# Altium schematic sheet IMU.SchDoc: MPU6000 IMU
size Letter; Revision: 1; SheetNumber: 3; SheetTotal: 3; Client: Facebook; LeaflabsProject: Sawyer
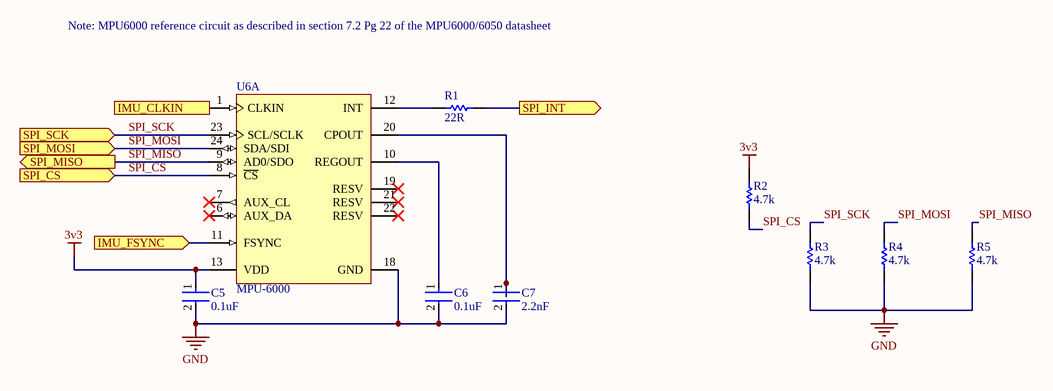
[diagram p0: IMU.SchDoc]

## Parts
C5  0.1uF  [FP-CC0603-DA-IPC_C]
C6  0.1uF  [FP-CC0603-DA-IPC_C]
C7  2.2nF  [FP-CC0603-DA-IPC_C]
R1  22R  [RESC1609X50X30LL10T20]
R2  4.7k  [RESC1609X50X30LL10T20]
R3  4.7k  [RESC1609X50X30LL10T20]
R4  4.7k  [RESC1609X50X30LL10T20]
R5  4.7k  [RESC1609X50X30LL10T20]
U6  MPU-6000  [QFN-24_NoPad]  (part A of 2)

## Ports
IMU_CLKIN (in), IMU_FSYNC (in), SPI_CS (in), SPI_INT (out), SPI_MISO (out), SPI_MOSI (in), SPI_SCK (in)

## Nets
3v3: C5.1 R2.2 U6.13(VDD)
GND: C5.2 C6.2 C7.2 R3.1 R4.1 R5.1 U6.18(GND)
IMU_CLKIN: U6.1(CLKIN) ; port IMU_CLKIN
IMU_FSYNC: U6.11(FSYNC) ; port IMU_FSYNC
SPI_CS: R2.1 U6.8(~{CS}) ; port SPI_CS
SPI_INT: R1.2 ; port SPI_INT
SPI_MISO: R5.2 U6.9(AD0/SDO) ; port SPI_MISO
SPI_MOSI: R4.2 U6.24(SDA/SDI) ; port SPI_MOSI
SPI_SCK: R3.2 U6.23(SCL/SCLK) ; port SPI_SCK
NetC6_1: C6.1 U6.10(REGOUT)
NetC7_1: C7.1 U6.20(CPOUT)
NetR1_1: R1.1 U6.12(INT)

Not connected (* = marked no-connect by the designer): U6 6(AUX_DA)* 7(AUX_CL)* 19(RESV)* 21(RESV)* 22(RESV)*

## Notes on the sheet
- Note: MPU6000 reference circuit as described in section 7.2 Pg 22 of the MPU6000/6050 datasheet
- PROJ
- TITLE
- CLIENT
- REV
- DATE
- LeafLabs
- SHEET
- OF
- CONFIDENTIAL. DO NOT DISTRIBUTE.

## Library data of the parts
C5 C6 = CAP-0603-0.1uF: CAP CER 0.1UF 16V X7R 0603; Manufacturer Part Number: CC0603KRX7R7BB104; Manufacturer: YAGEO; Tolerance: 0.1; Value: 100 nF; Temperature Coefficient: 15%; Material: Ceramic; Voltage Rating: 16 V; Package: CC0603-DA; ComponentLink2Description: Datasheet; Octopart: https://octopart.com/cc0603krx7r7bb104-yageo-192941; Temperature Range High: +125°C; Digikey Description: CAP CER 0.1UF 16V X7R 0603; Voltage: 16 V; Device Class L2: Capacitors; Height: 0.9mm; Temperature: -55°C to +125°C; Device Class L1: Passive Components; Device Class L3: Ceramic Capacitors; ComponentLink2URL: http://www.yageo.com/documents/recent/UPY-GPHC_X7R_6.3V-to-50V_18.pdf; Footprint Url: http://www.yageo.com/exep/pages/download/literatures/UPY-C_GEN_24.pdf; RoHS: TRUE; Temperature Range Low: -55°C; Temperature Characteristic: X7R; Lead Free: Yes; Capacitance: 100 nF; Category: Cap; Mouser Description: Multilayer Ceramic Capacitor, CC Series, 0.1 - F, - 10%, X7R, 16 V, 0603 [1608 Metric]; Automotive: No; Supplier 1: Digi-Key; Supplier Part Number 1: 311-1088-1-ND
C7 = CAP-0603-2.2nF: CAP CER 2.2nF 50V X7R 0603; Tolerance: 0.1; Voltage Rating: 50 V; ComponentLink2Description: Datasheet; Temperature Range High: +125°C; Device Class L2: Capacitors; ComponentLink2URL: http://www.yageo.com/documents/recent/UPY-GPHC_X7R_6.3V-to-50V_18.pdf; Category: Cap; Supplier 1: Digi-Key; Supplier Part Number 1: 311-1081-1-ND
R1 = RES-0603-22R: Resistor 0603 22 Ohm; Supplier 1: Digi-Key; Supplier Part Number 1: CR0603-JW-220ELFCT-ND
R2-R5 = RES-0603-4.7k: Resistor 0603 4.7k Ohm; Supplier 1: Digi-Key; Supplier Part Number 1: CR0603-JW-472ELFCT-ND
U6 = MPU-6000: 3-Axis Gyroscope 3-Axis Accelerometer Motion Processing Unit with I2C and SPI, 2.5, 3 or 3.3 V, -40 to 85 degC, 24-Pin QFN, RoHS, Tape and Reel; Manufacturer: InvenSense; Featured Product: MPU60006AxisIntegratedSPISolution; Output Type: I²C,SPI; Sensor Type: Accelerometer,Gyroscope,3Axis; Other Names: 1428-1005-2 / MPU6000; Online Catalog: MPU-6000™Series; Operating Temperature: -40degC~85degC(TA); Datasheet URL: https://www.invensense.com/wp-content/uploads/2015/02/MPU-6000-Datasheet1.pdf; Manufacturer URL: http://www.invensense.com/; Datasheet Version: Rev. 3.4, 08/2013; Standard Package: 5,000; Family: Multifunction; Package Reference: QFN-24; Category: Sensors,Transducers; Package Description: 24-Pin Quad Flat No-lead Package, Body 4 x 4 mm, Pitch 0.5 mm; Supplier 1: Digi-Key; Supplier Part Number 1: 1428-1005-1-ND